# Altium schematic sheet Main.SchDoc
size A4
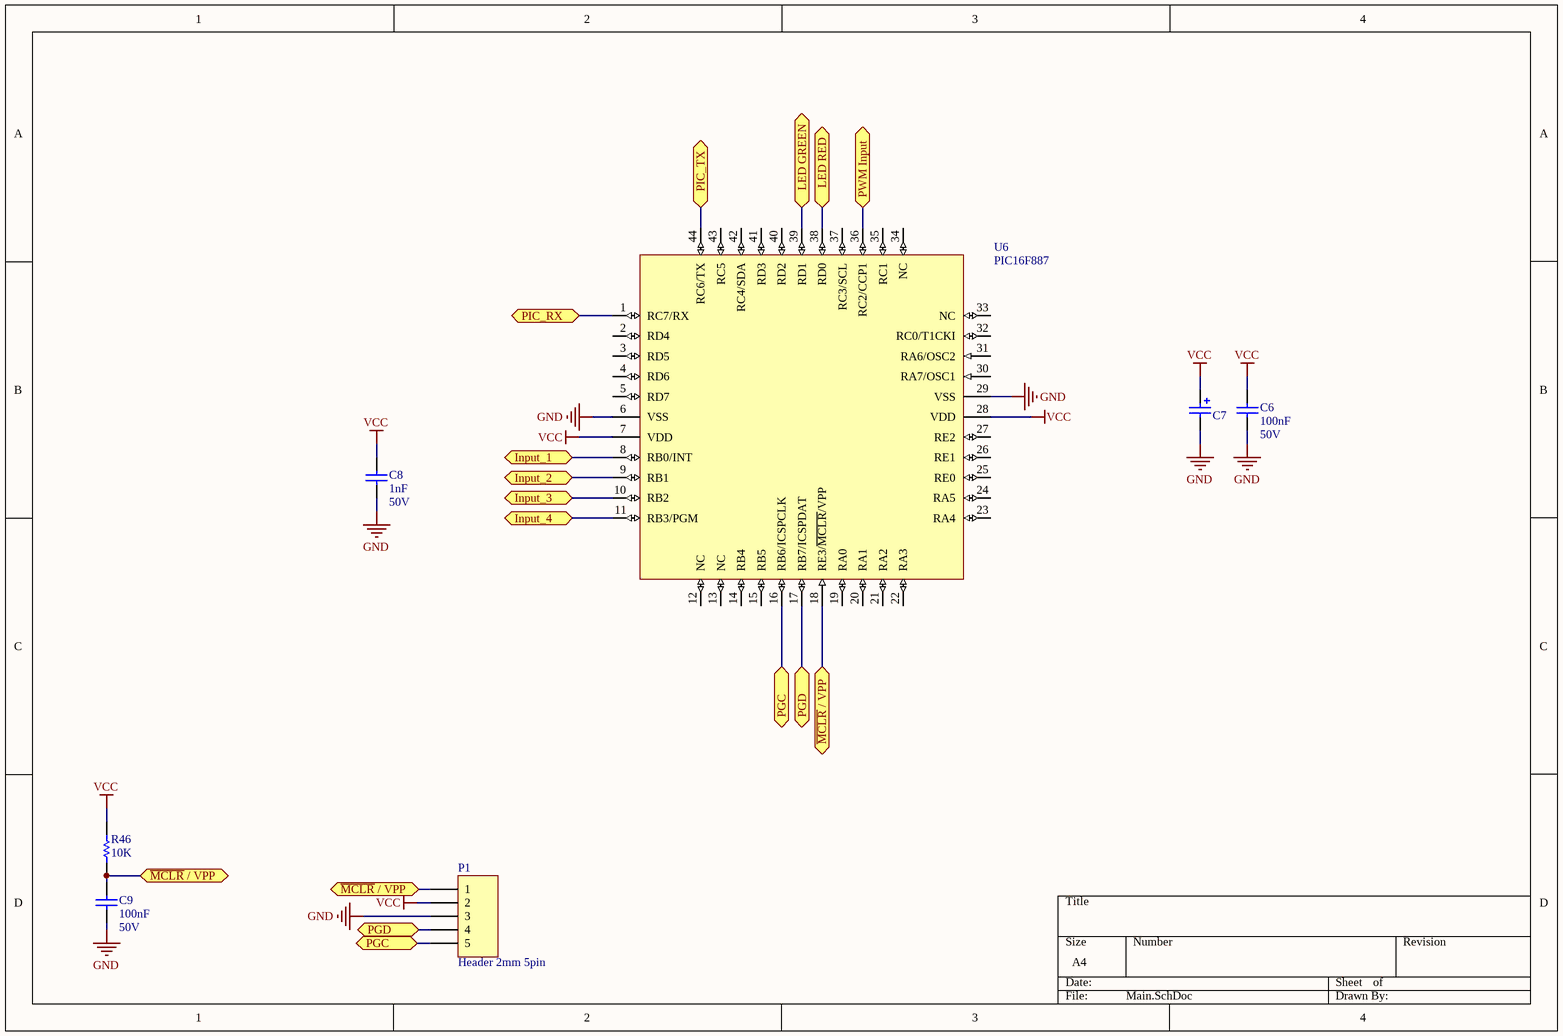
[diagram p0: Main.SchDoc]

## Parts
C6  value 100nF  Voltage: 50V  [3-0603_L]  (hidden comment: Cap)
C7  CAP-Tantal  [3528]  (value not drawn)
C8  value 1nF  Voltage: 50V  [3-0603_L]  (hidden comment: Cap)
C9  value 100nF  Voltage: 50V  [3-0603_L]  (hidden comment: Cap)
P1  Header 2mm 5pin  [Header 2mm 5Pin]
R46  value 10K  [3-0603_L]  (hidden comment: Res1)
U6  PIC16F887  [TQFP-44]

## Ports
Input_1 (bidir), Input_2 (bidir), Input_3 (bidir), Input_4 (bidir), LED GREEN (bidir), LED RED (bidir), PGC (bidir), PGD (bidir), PIC_RX (bidir), PIC_TX (bidir), PWM Input (bidir), ~{MCLR} / VPP (bidir)

## Nets
GND: C6.2 C7.2 C8.2 C9.2 P1.3 U6.6(VSS) U6.29(VSS)
VCC: C6.1 C7.1 C8.1 P1.2 R46.2 U6.7(VDD) U6.28(VDD)
~{MCLR} / VPP: C9.1 P1.1 R46.1 U6.18(RE3/~{MCLR}/VPP) ; port ~{MCLR} / VPP
Input_1: U6.8(RB0/INT) ; port Input_1
Input_2: U6.9(RB1) ; port Input_2
Input_3: U6.10(RB2) ; port Input_3
Input_4: U6.11(RB3/PGM) ; port Input_4
LED GREEN: U6.39(RD1) ; port LED GREEN
LED RED: U6.38(RD0) ; port LED RED
PGC: P1.5 U6.16(RB6/ICSPCLK) ; port PGC
PGD: P1.4 U6.17(RB7/ICSPDAT) ; port PGD
PIC_RX: U6.1(RC7/RX) ; port PIC_RX
PIC_TX: U6.44(RC6/TX) ; port PIC_TX
PWM Input: U6.36(RC2/CCP1) ; port PWM Input

Not connected (* = marked no-connect by the designer): U6 2(RD4) 3(RD5) 4(RD6) 5(RD7) 12(NC) 13(NC) 14(RB4) 15(RB5) 19(RA0) 20(RA1) 21(RA2) 22(RA3) 23(RA4) 24(RA5) 25(RE0) 26(RE1) 27(RE2) 30(RA7/OSC1) 31(RA6/OSC2) 32(RC0/T1CKI) 33(NC) 34(NC) 35(RC1) 37(RC3/SCL) 40(RD2) 41(RD3) 42(RC4/SDA) 43(RC5)

## Library data of the parts
C6 C8 C9 = Cap: Capacitor; Published: 8-Jun-2000; Revision: July-2002: Re-released for DXP Platform.; Publisher: Altium Limited
C7 = CAP-Tantal: Tantamount Military, Surface Mount MIL-PRF-55365/8 Qualified Solid Tantalum Chip Capacitor: 6.8uF, 20% Tolerance, 6 WVDC @ +85°C, Surge = 8V; Note: See Data Sheet for full range of components; Value: 22uF; Voltage: 10V; Published: 19-Mar-2004; DatasheetDocument: 20-Mar-2003; PackageReference: 3528; Publisher: Altium Limited; Code_JEITA: 3528; ComponentLink1Description: Manufacturer Link; ComponentLink1URL: http://www.vishay.com/; ComponentLink2Description: Datasheet; ComponentLink2URL: http://www.vishay.com/docs/40011/cwr11.pdf
P1 = Header 2mm 5pin: Header 2mm , 5-Pin; LatestRevisionDate: 17-Jul-2002; LatestRevisionNote: Re-released for DXP Platform.; Publisher: Altium Limited
R46 = Res1: Resistor; Published: 8-Jun-2000; LatestRevisionDate: 17-Jul-2002; LatestRevisionNote: Re-released for DXP Platform.; PackageReference: AXIAL-0.3; Publisher: Altium Limited
U6 = PIC16F887: EPROM-Based 8-Bit CMOS Microcontroller; Package Information: Latest Revision: 1998; Published: 8-Jun-2000; Revision: 17-Jul-2002: Re-released for DXP Platform.; Datasheet: Latest Revision: 1998; Package Reference: JW18; Publisher: Altium Limited